# EAGLE design irsensor (EAGLE 9.6.2)
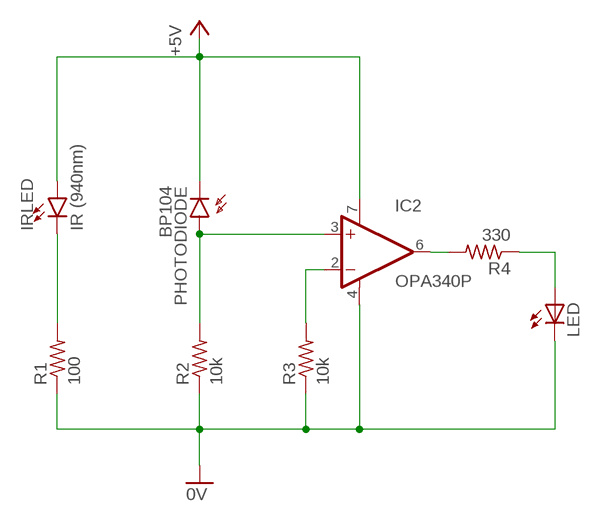
[diagram p0: schematic, sheet 1]

## Parts
IC2  OPA340P  [DIL08]
IRLED  IR (940nm)  LED-IRTSAL6100  [LED_5MM]
LED  LED5MM  [LED5MM]
PHOTODIODE  BP104  [BP104]
R1  100  R-US_0204/2V  [0204V]
R2  10k  R-US_0204/2V  [0204V]
R3  10k  R-US_0204/2V  [0204V]
R4  330  R-US_0204/2V  [0204V]

## Nets
0V: IC2.4(V-) LED.K(C) R1.1 R2.1 R3.1
+5V: IC2.7(V+) IRLED.A PHOTODIODE.K(C)
N$1: IRLED.K(C) R1.2
N$3: IC2.3(+IN) PHOTODIODE.A R2.2
N$4: IC2.6(OUT) R4.2
N$5: LED.A R4.1
N$7: IC2.2(-IN) R3.2

## Library data of the parts
IC2 = burr-brown:OPA340: Rail-to-Rail Operational Amplifiers Single-Supply, MicroAmplifier(TM) Series; MPN: OPA340PA; OC_FARNELL: 1097413; OC_NEWARK: 97K6826
IRLED = SparkFun-LED:LED-IR: Infrared LED (IR) Wavelength: 940nm Packages: TSAL6100 LTE302 - Side firing. Check SparkFun-Sensors.lbr for the receiver SparkFun Products: ZX Distance and Gesture Sensor <[https://www.sparkfun.com/products/12780]> Infrared Emitters and Detectors <https://www.sparkfun.com/products/241>; PROD_ID: DIO-12058
LED = adafruit:LED: LED OSRAM: - CHIPLED LG R971, LG N971, LY N971, LG Q971, LY Q971, LO R971, LY R971 LH N974, LH R974 LS Q976, LO Q976, LY Q976 LO Q996 - Hyper CHIPLED LW Q18S LB Q993, LB Q99A, LB R99A - SideLED LS A670, LO A670, LY A670, LG A670, LP A670 LB A673, LV A673, LT A673, LW A673 LH A674 LY A675 LS A676, LA A676, LO A676, LY A676, LW A676 LS A679, LY A679, LG A679 - Hyper Micro SIDELED® LS Y876, LA Y876, LO Y876, LY Y876 LT Y87S - SmartLED LW L88C, LW L88S LB L89C, LB L89S, LG L890 LS L89K, LO L89K, LY L89K LS L896, LA L896, LO L896, LY L896 - TOPLED LS T670, LO T670, LY T670, LG T670, LP T670 LSG T670, LSP T670, LSY T670, LOP T670, LYG T670 LG T671, LOG T671, LSG T671 LB T673, LV T673, LT T673, LW T673 LH T674 LS T676, LA T676, LO T676, LY T676, LB T676, LH T676, LSB T676, LW T676 LB T67C, LV T67C, LT T67C, LS T67K, LO T67K, LY T67K, LW E67C LS E67B, LA E67B, LO E67B, LY E67B, LB E67C, LV E67C, LT E67C LW T67C LS T679, LY T679, LG T679 LS T770, LO T770, LY T770, LG T770, LP T770 LB T773, LV T773, LT T773, LW T773 LH T774 LS E675, LA E675, LY E675, LS T675 LS T776, LA T776, LO T776, LY T776, LB T776 LHGB T686 LT T68C, LB T68C - Hyper Mini TOPLED® LB M676 - Mini TOPLED Santana® LG M470 LS M47K, LO M47K, LY M47K Source: http://www.osram.convergy.de/
PHOTODIODE = opto-trans-siemens:BP104: PHOTO DIODE; MF: VISHAY/TELEFUNKEN; MPN: BP104; OC_FARNELL: 1779636; OC_NEWARK: 14M4504
R1 R2 = adafruit:R-US_: RESISTOR, American symbol
R3 R4 = rcl:R-US_: RESISTOR, American symbol; SPICEPREFIX: R

## Board
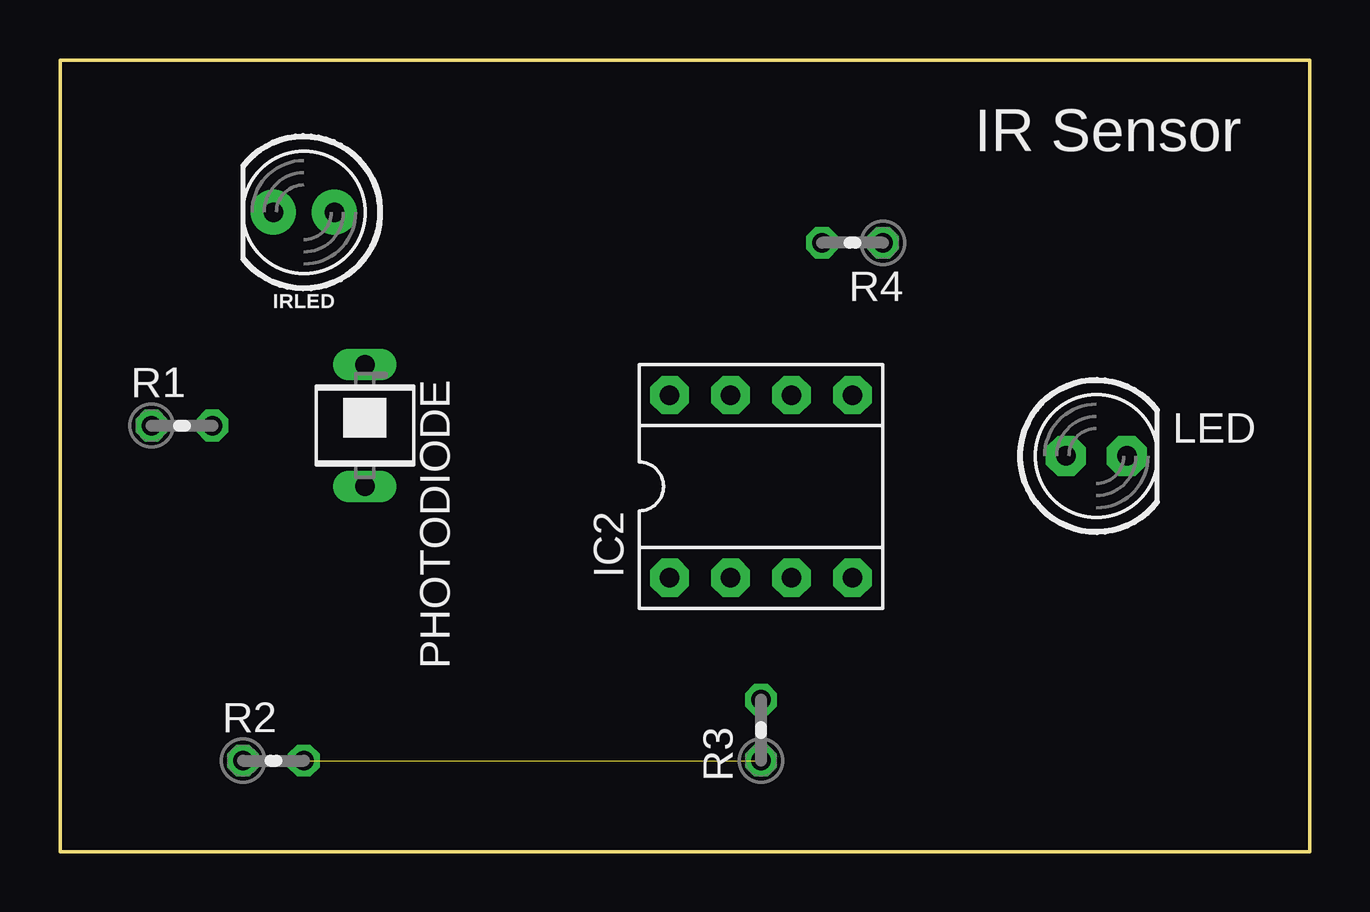
[diagram p1: board, top side]
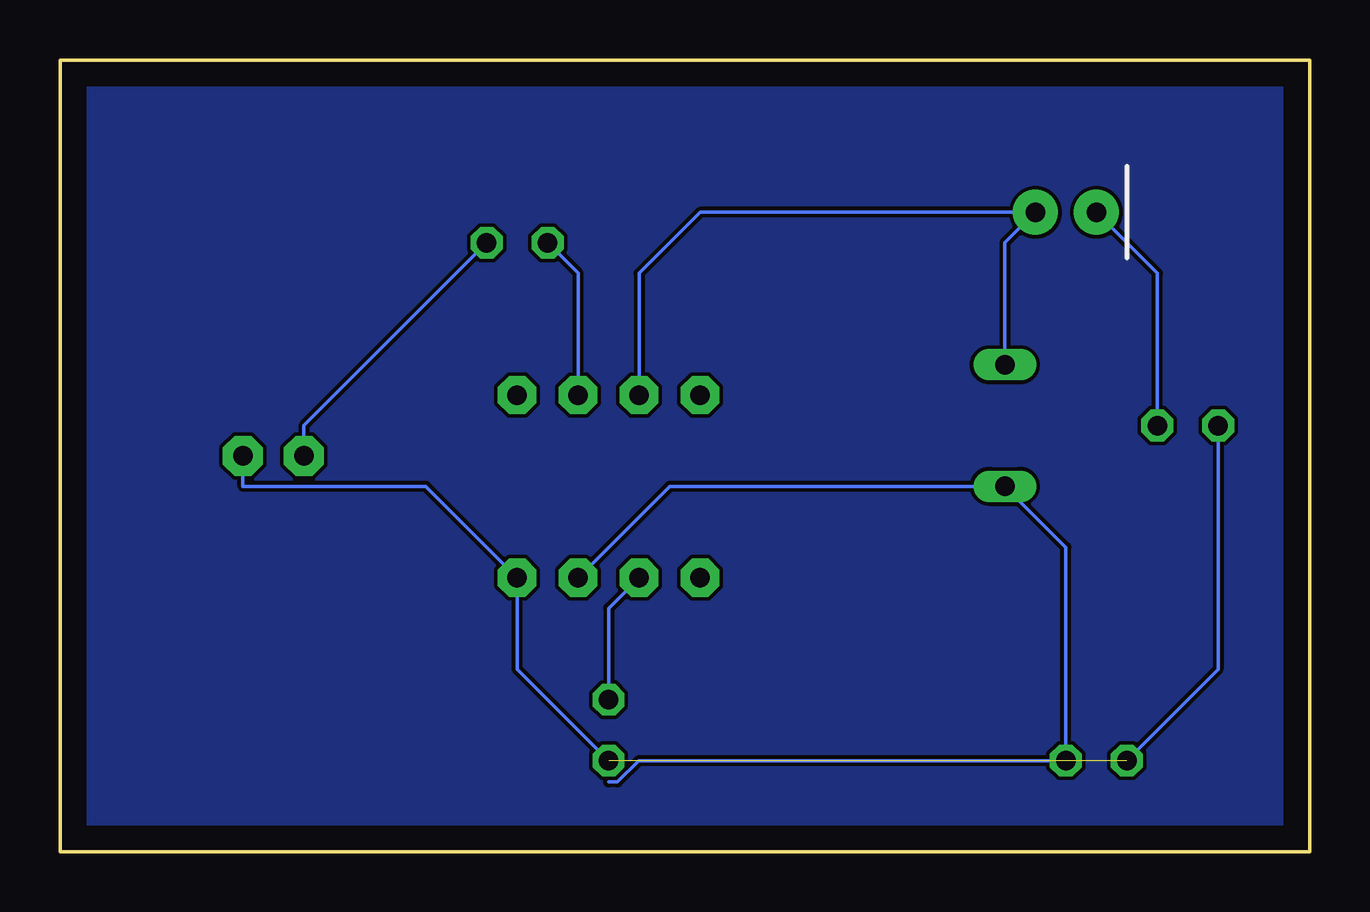
[diagram p2: board, bottom side, seen from below]

Size 52.07 x 33.02 mm. Coordinates in mm from the lower left corner, seen from the top.
Outline: 0,33.02 0,0 52.07,0 52.07,30.48 52.07,31.75 52.07,33.02 0,33.02
Copper layers (1*16): Top 0.035mm / dielectric 1.5mm / Bottom 0.035mm
Design rules "default": minimum track width 6mil, minimum drill 0.35mm, track to track 6mil, track to pad 6mil, pad to pad 6mil, via to via 6mil, smd to smd 6mil, copper to edge 40mil, drill to drill 6mil, minimum pad ring 10mil, minimum via ring 8mil, stop-mask expansion 4mil, vias tented up to drill 0mil, thermal gap 10mil

### Footprints (pad centres in the part's own frame; a part is rotated, then mirrored left to right if it is on the bottom)
DIL08 = drill 0.813 pad 1.6 octagon: 1 -3.81,-3.81; 2 -1.27,-3.81; 3 1.27,-3.81; 4 3.81,-3.81; 5 3.81,3.81; 6 1.27,3.81; 7 -1.27,3.81; 8 -3.81,3.81
LED_5MM = drill 0.813 pad 1.88: A -1.27,0; K 1.27,0
LED5MM = drill 0.813 pad 1.676 octagon: A -1.27,0; K 1.27,0
BP104 = drill 0.813 long: A 0,2.54; K 0,-2.54
0204V = drill 0.813 octagon: 1 -1.27,0; 2 1.27,0

### Placement (x,y rotation side)
IC2  29.21,15.24 0 top
IRLED  10.16,26.67 180 top
LED  43.18,16.51 0 top
PHOTODIODE  12.7,17.78 180 top
R1  5.08,17.78 0 top
R2  8.89,3.81 0 top
R3  29.21,5.08 90 top
R4  33.02,25.4 180 top

### Tracks (layer width: path | path; a pad name or v marks a point on that pad's centre or on a via)
0V  (1 unrouted)
  Bottom 0.152: R1.1 3.81,7.62 R2.1 | R3.1 33.02,7.62 IC2.4 36.83,15.24 44.45,15.24 LED.K
+5V
  Bottom 0.152: IC2.7 27.94,24.13 25.4,26.67 IRLED.A 12.7,25.4 PHOTODIODE.K
GND
  pour Bottom: 0,33.02 52.07,33.02 52.07,0 0,0
  pour Bottom: 3.81,33.02 52.07,33.02 52.07,0 0,0 0,33.02
N$1
  Bottom 0.152: R1.2 6.35,24.13 IRLED.K
N$3
  Bottom 0.152: IC2.3 26.67,15.24 PHOTODIODE.A 10.16,12.7 R2.2 27.95,3.81 28.84,2.92 29.21,2.92
N$4
  Bottom 0.152: IC2.6 30.48,24.13 R4.2
N$5
  Bottom 0.152: R4.1 41.91,17.78 LED.A
N$7
  Bottom 0.152: IC2.2 29.21,10.16 R3.2

### Text on the board
tNames: IR Sensor